# Altium schematic sheet MCU-PINS.SchDoc
size A; SheetNumber: 2; SheetTotal: 3
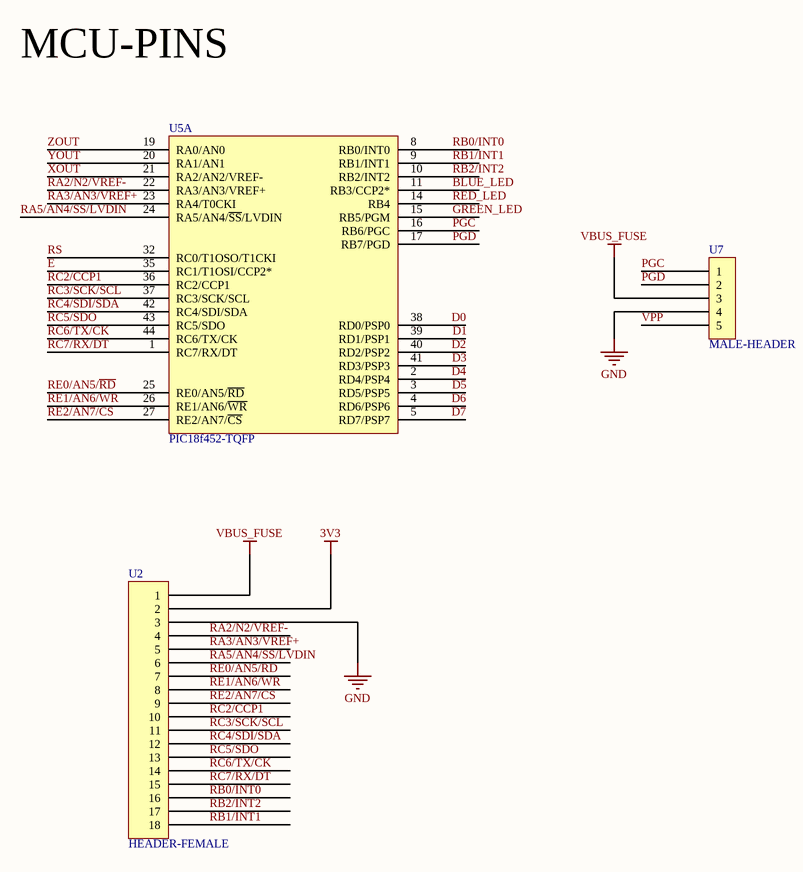
[diagram p0: MCU-PINS.SchDoc]

## Parts
U2  HEADER-FEMALE  [PCBComponent_1]
U5  PIC18f452-TQFP  [PCBComponent_1]  (part A of 2)
U7  MALE-HEADER  [PCBComponent_1]

## Nets
3V3: U2.2
GND: U2.3 U7.4
VBUS_FUSE: U2.1 U7.3
BLUE_LED: U5.11(RB3/CCP2*)
D0: U5.38(RD0/PSP0)
D1: U5.39(RD1/PSP1)
D2: U5.40(RD2/PSP2)
D3: U5.41(RD3/PSP3)
D4: U5.2(RD4/PSP4)
D5: U5.3(RD5/PSP5)
D6: U5.4(RD6/PSP6)
D7: U5.5(RD7/PSP7)
E: U5.35(RC1/T1OSI/CCP2*)
GREEN_LED: U5.15(RB5/PGM)
PGC: U5.16(RB6/PGC) U7.1
PGD: U5.17(RB7/PGD) U7.2
RA2/N2/VREF-: U2.4 U5.22(RA3/AN3/VREF+)
RA3/AN3/VREF+: U2.5 U5.23(RA4/T0CKI)
RA5/AN4/~{SS}/LVDIN: U2.6 U5.24(RA5/AN4/~{SS}/LVDIN)
RB0/INT0: U2.16 U5.8(RB0/INT0)
RB1/INT1: U2.18 U5.9(RB1/INT1)
RB2/INT2: U2.17 U5.10(RB2/INT2)
RC2/CCP1: U2.10 U5.36(RC2/CCP1)
RC3/SCK/SCL: U2.11 U5.37(RC3/SCK/SCL)
RC4/SDI/SDA: U2.12 U5.42(RC4/SDI/SDA)
RC5/SDO: U2.13 U5.43(RC5/SDO)
RC6/TX/CK: U2.14 U5.44(RC6/TX/CK)
RC7/RX/DT: U2.15 U5.1(RC7/RX/DT)
RE0/AN5/~{RD}: U2.7 U5.25(RE0/AN5/~{RD})
RE1/AN6/~{WR}: U2.8 U5.26(RE1/AN6/~{WR})
RE2/AN7/~{CS}: U2.9 U5.27(RE2/AN7/~{CS})
RED_LED: U5.14(RB4)
RS: U5.32(RC0/T1OSO/T1CKI)
VPP: U7.5
XOUT: U5.21(RA2/AN2/VREF-)
YOUT: U5.20(RA1/AN1)
ZOUT: U5.19(RA0/AN0)

## Notes on the sheet
- MCU-PINS

## Library data of the parts
U2 = L-KLS1-208B-4.0-1-18-S
U7 = 5-PINS-MALE-HEADER